# Altium project WingDriverv1.PrjPcb
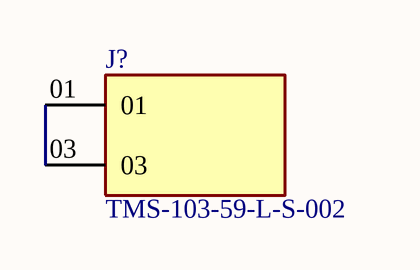
[diagram p0: Sheet1.SchDoc]
1 sheet, 1 parts. Net scope: global (net labels, ports and power ports of the same name join across sheets).
Board file: PCB1.PcbDoc

## Sheet Sheet1.SchDoc
size A4; SheetNumber: 1; SheetTotal: 1

### Parts
J?  TMS-103-59-L-S-002  [SAMTEC_TMS-103-59-L-S-002]

### Nets
NetJ?_01: J?.01 J?.03

### Library data of the parts
J? = TMS-103-59-L-S-002: Package: None; Price: None; Value: *; MP: TMS-103-59-L-S-002; Availability: Unavailable